# EAGLE design rcv_board (EAGLE 9.6.2)
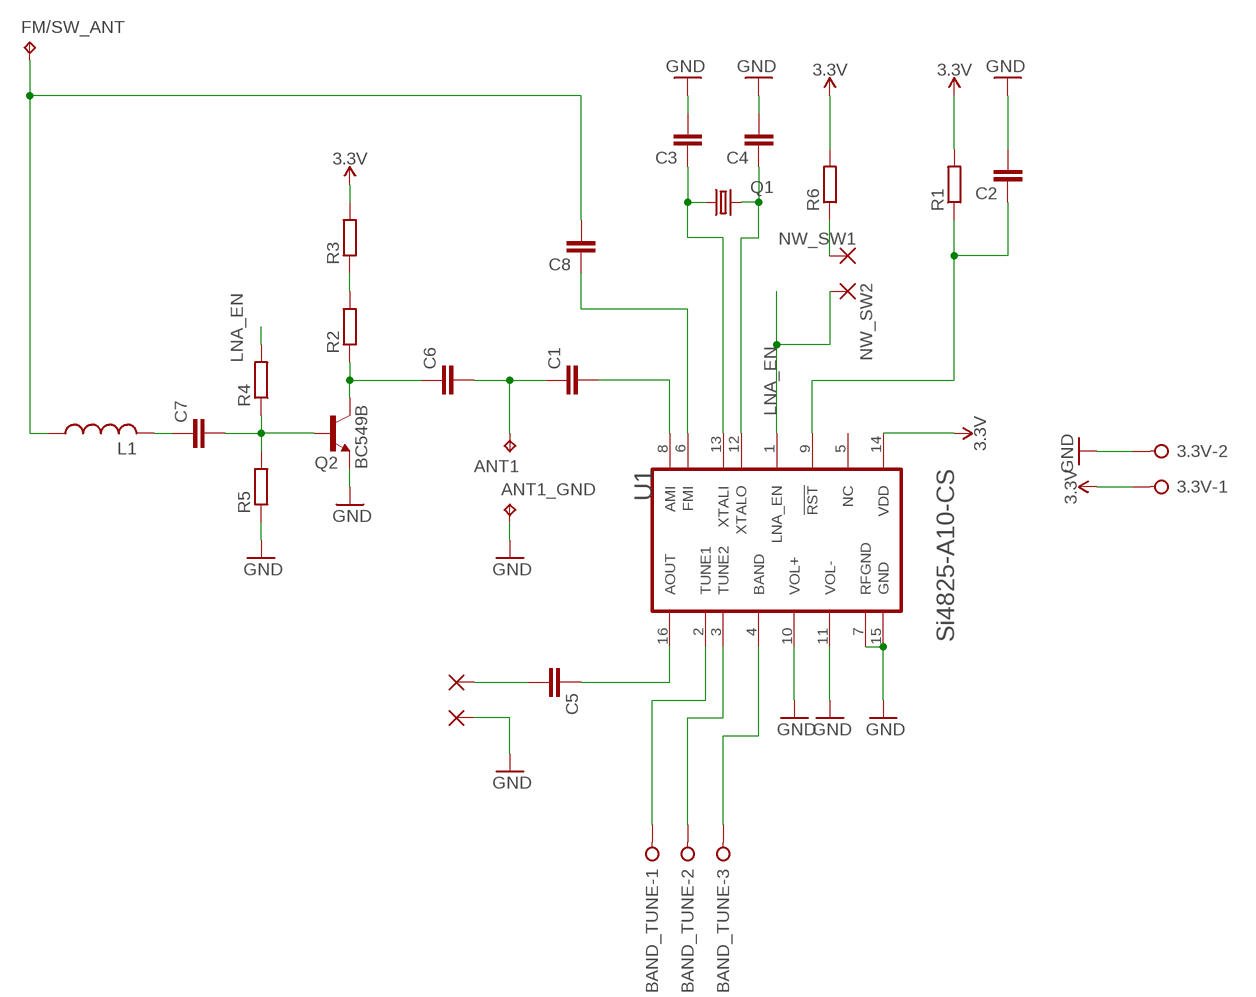
[diagram p0: schematic, sheet 1]

## Parts
3.3V  W237-02P  [W237-132]
ANT1  TPPAD1-20Y  [P1-20Y]
ANT1_GND  TPPAD1-20Y  [P1-20Y]
BAND_TUNE  W237-03P  [W237-133]
C1  C-EUC0805  [C0805]
C2  C-EUC0805  [C0805]
C3  C-EUC0805  [C0805]
C4  C-EUC0805  [C0805]
C5  C-EU050-035X075  [C050-035X075]
C6  C-EUC0805  [C0805]
C7  C-EUC0805  [C0805]
C8  C-EUC0805  [C0805]
FM/SW_ANT  TPPAD1-17  [P1-17]
L1  L-US0204V  [0204V]
OGND  NW_SW1  2,54/1,0  [2,54/1,0]
OUT  NW_SW1  2,54/1,0  [2,54/1,0]
PAD1  NW_SW1  2,54/1,0  [2,54/1,0]
PAD2  NW_SW2  2,54/1,0  [2,54/1,0]
Q1  KX-327-NHF  [3.2X1.5]
Q2  BC549B  [TO92-EBC]
R1  R-EU_R0805  [R0805]
R2  R-EU_R0805  [R0805]
R3  R-EU_R0805  [R0805]
R4  R-EU_R0805  [R0805]
R5  R-EU_R0805  [R0805]
R6  R-EU_R0805  [R0805]
U1  SILICON_LABS_SI4825-A10-CSSILICON_LABS_SI4825-A10-CS_0_2  [SILICON_LABS_SI4825-A10-CS_2]

## Nets
3.3V: 3.3V.1 R1.2 R3.2 R6.2 U1.14(VDD)
GND: 3.3V.2 ANT1_GND.TP C2.2 C3.2 C4.2 OGND.1(P) Q2.E R5.1 U1.7(RFGND) U1.10(VOL+) U1.11(VOL-) U1.15(GND)
LNA_EN: PAD2.1(P) R4.2 U1.1(LNA_EN)
N$1: C1.2 U1.8(AMI)
N$2: C2.1 R1.1 U1.9(!RST!)
N$3: C4.1 Q1.2 U1.12(XTALO)
N$4: C3.1 Q1.1 U1.13(XTALI)
N$5: C5.1 U1.16(AOUT)
N$6: C6.1 Q2.C R2.1
N$7: ANT1.TP C1.1 C6.2
N$8: R2.2 R3.1
N$9: C7.2 Q2.B R4.1 R5.2
N$10: C8.1 U1.6(FMI)
N$11: C7.1 L1.2
N$12: C8.2 FM/SW_ANT.TP L1.1
N$13: PAD1.1(P) R6.1
N$14: BAND_TUNE.3 U1.4(BAND)
N$15: BAND_TUNE.2 U1.3(TUNE2)
N$16: BAND_TUNE.1 U1.2(TUNE1)
N$17: C5.2 OUT.1(P)
Unconnected: U1.5(NC)

## Library data of the parts
3.3V = con-wago-508:W237-02P: WAGO SREW CLAMP; OC_FARNELL: unknown; OC_NEWARK: unknown
ANT1 ANT1_GND FM/SW_ANT = testpad:TP: Test pad
BAND_TUNE = con-wago-508:W237-03P: WAGO SREW CLAMP; OC_FARNELL: unknown; OC_NEWARK: unknown
C1-C8 = rcl:C-EU: CAPACITOR, European symbol; SPICEPREFIX: C
L1 = rcl:L-US: INDUCTOR, American symbol; SPICEPREFIX: L
OGND OUT PAD1 PAD2 = wirepad:2,54/1,0: THROUGH-HOLE PAD
Q1 = crystal-geyer_V1_0:KX-327: Tuning Fork Crystals (kHz) SMD: KX327 - Serie Model Size l/w/h [mm] Frequency Range Frequency Stability Temp. Range [°C] Load Capacitance AECQ 200 availabel Datasheet KX-327VT KX-327FT KX-327RT KX-327NHT KX-327NHF KX-327L KX-327S 1.25/1.05/0.5 1.6/1.0/0.5 2.0/1.2/0.6 3.2/1.5/0.8 3.2/1.5/0.8 7.0/1.5/1.4 8.2/3.8/2.5 32,768 kHz 32,768 kHz 32,768 kHz 32,768 kHz 32,768 kHz 32,768 kHz 32,768 kHz ±10 … ±20ppm ±10 … ±20ppm ±10 … ±20ppm ±10 … ±20ppm ±10 … ±20ppm ±10 … ±20ppm ±5 … ±20ppm (*) -40°C …+85°C (*) -40°C …+85°C (*) -40°C …+85°C (*) -40°C …+85°C (*) -40°C …+125°C (*) -40°C …+85°C (*) -40°C …+85°C 7/9/12,5 7/9/12,5 7/9/12,6 7/9/12,5 9/12,5 7/9/12,5 6/12,5 - - - - yes - - KX-327VT.pdf <http://www.geyer-electronic.de/uploads/tx_userartikelfrequenz/GEYER-KX-327VT.pdf> KX-327FT.pdf <http://www.geyer-electronic.de/uploads/tx_userartikelfrequenz/GEYER-KX-327FT.pdf> KX-327RT.pdf <http://www.geyer-electronic.de/uploads/tx_userartikelfrequenz/GEYER-KX-327RT.pdf> KX-327NHT.pdf <http://www.geyer-electronic.de/uploads/tx_userartikelfrequenz/GEYER-KX-327NHT.pdf> KX-327NHF.pdf <http://www.geyer-electronic.de/uploads/tx_userartikelfrequenz/GEYER-KX-327NHF.pdf> KX-327L.pdf <http://www.geyer-electronic.de/uploads/tx_userartikelfrequenz/GEYER-KX-327L.pdf> KX-327S.pdf <http://www.geyer-electronic.de/uploads/tx_userartikelfrequenz/GEYER-KX-327S.pdf> <http://www.geyer-electronic.de/fileadmin/template/img/logo-geyer-electronic.png> Details see: http://www.geyer-electronic.de/Frequenz-Produkte.9.0.html Created 2016-06-07, Hans Locher 2016 (C) Geyer Quartz Technology KX327VT,KX327FT,KX327RT,KX327NHT,KX327NHF,KX327S,KX327L;125105;1610;2012;3215;7015;8238;1,25x1,05,1.25x1.05;1,6x1,0,1.6x1.0;2,0x1,2,2.0x1.2;3,2x1,5,3.2x1.5;8,2x3,8,8.2x3.8,7.0x1.5,7,0x1,532.768kHz
Q2 = transistor-npn:BC549*: NPN Transistor
R1-R6 = rcl:R-EU_: RESISTOR, European symbol; SPICEPREFIX: R
U1 = Silicon Labs - Si4825-A10-CS:SILICON_LABS_SI4825-A10-CS: SLAB-Si4825-SOIC-16-NB-16; CIIVA_IDS: 8865163; CODE__IPC: J-STD-020; CODE__JEDEC: MS-012; COMPONENT_LINK_1_DESCRIPTION: Manufacturer URL; COMPONENT_LINK_1_URL: http://www.silabs.com/; COMPONENT_LINK_3_DESCRIPTION: Package Specification; COMPONENT_LINK_3_URL: http://www.silabs.com/Support%20Documents/TechnicalDocs/si2401.pdf; DATASHEET: http://www.silabs.com/Support Documents/TechnicalDocs/Si4825-A10.pdf; DATASHEET_VERSION: Rev. 1.0; FOOTPRINT_VARIANT_NAME_0: Level C; FOOTPRINT_VARIANT_NAME_1: Level B; FOOTPRINT_VARIANT_NAME_2: Level A; IMPORTED: yes; IMPORTED_FROM: vault; IMPORT_TS: 1521848159; MF: Silicon Labs; MOUNTING_TECHNOLOGY: Surface Mount; MPN: Si4825-A10-CS; PACKAGE: SOIC-16-NB; PACKAGE_DESCRIPTION: 16-Pin Small-Outline Integrated Circuit, Body 9.9 x 3.9 mm, Pitch 1.27 mm; PIN_0_0_12_INSIDE_EDGE: clock; PREFIX: U; RDS_SUPPORT: false; RELEASE_DATE: 1382427841; SUB__FAMILY: AM/FM, Shortwave, Longwave, Weather Band Receivers; VAULT_GUID: FF627C0C-6F04-4CD9-A8DD-D8BCD44C89B6; VAULT_REVISION: 47CE571D-67E0-476C-8CEC-131F609130D3

## Board
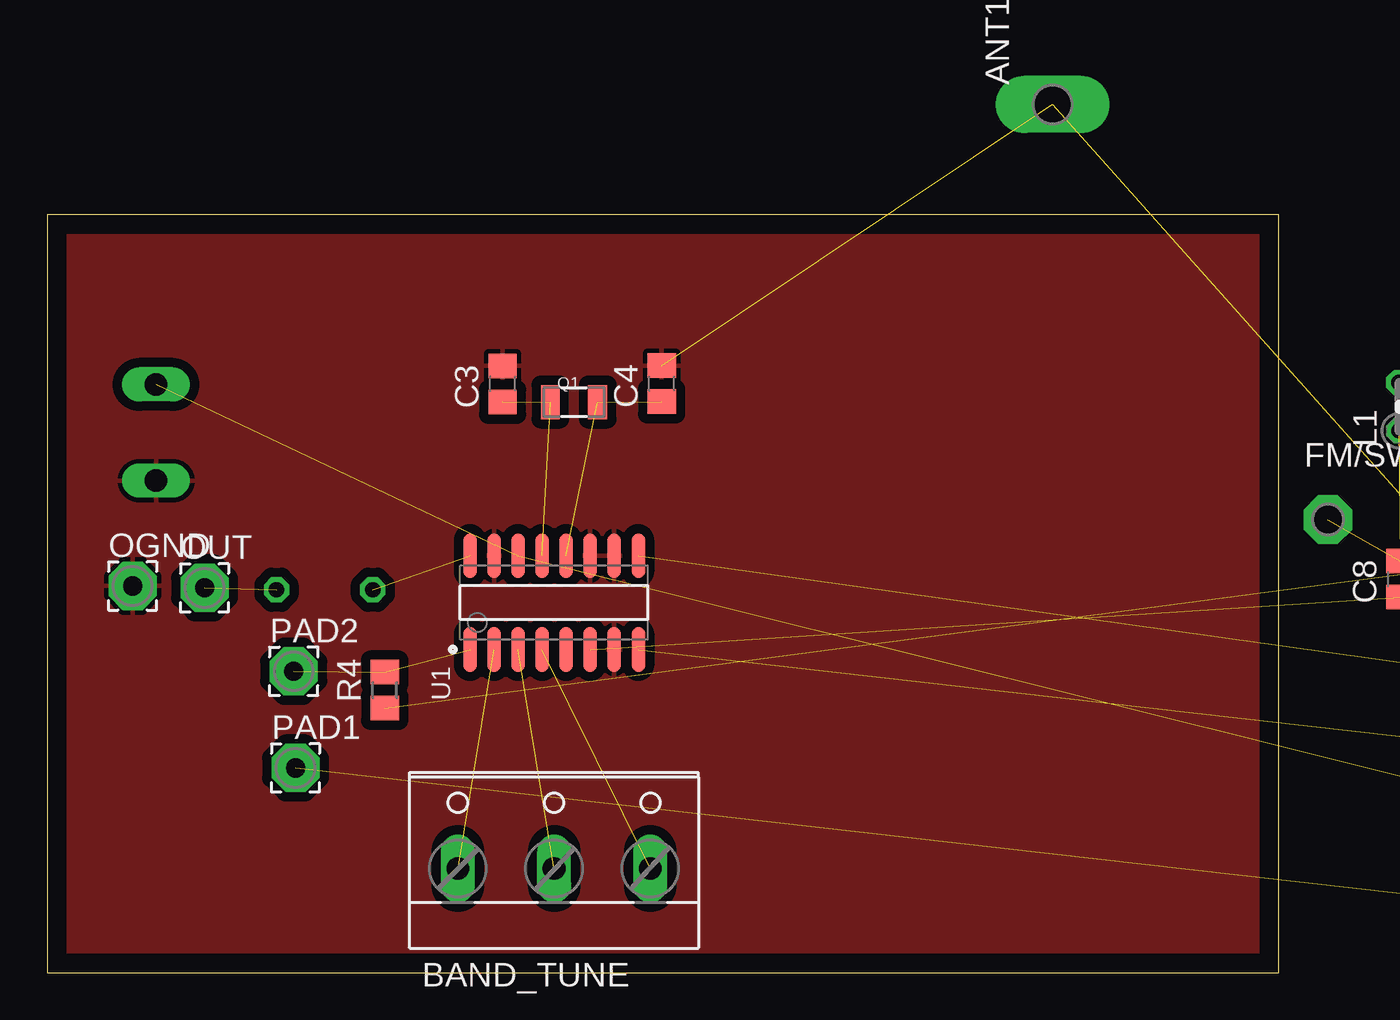
[diagram p1: board, top side]
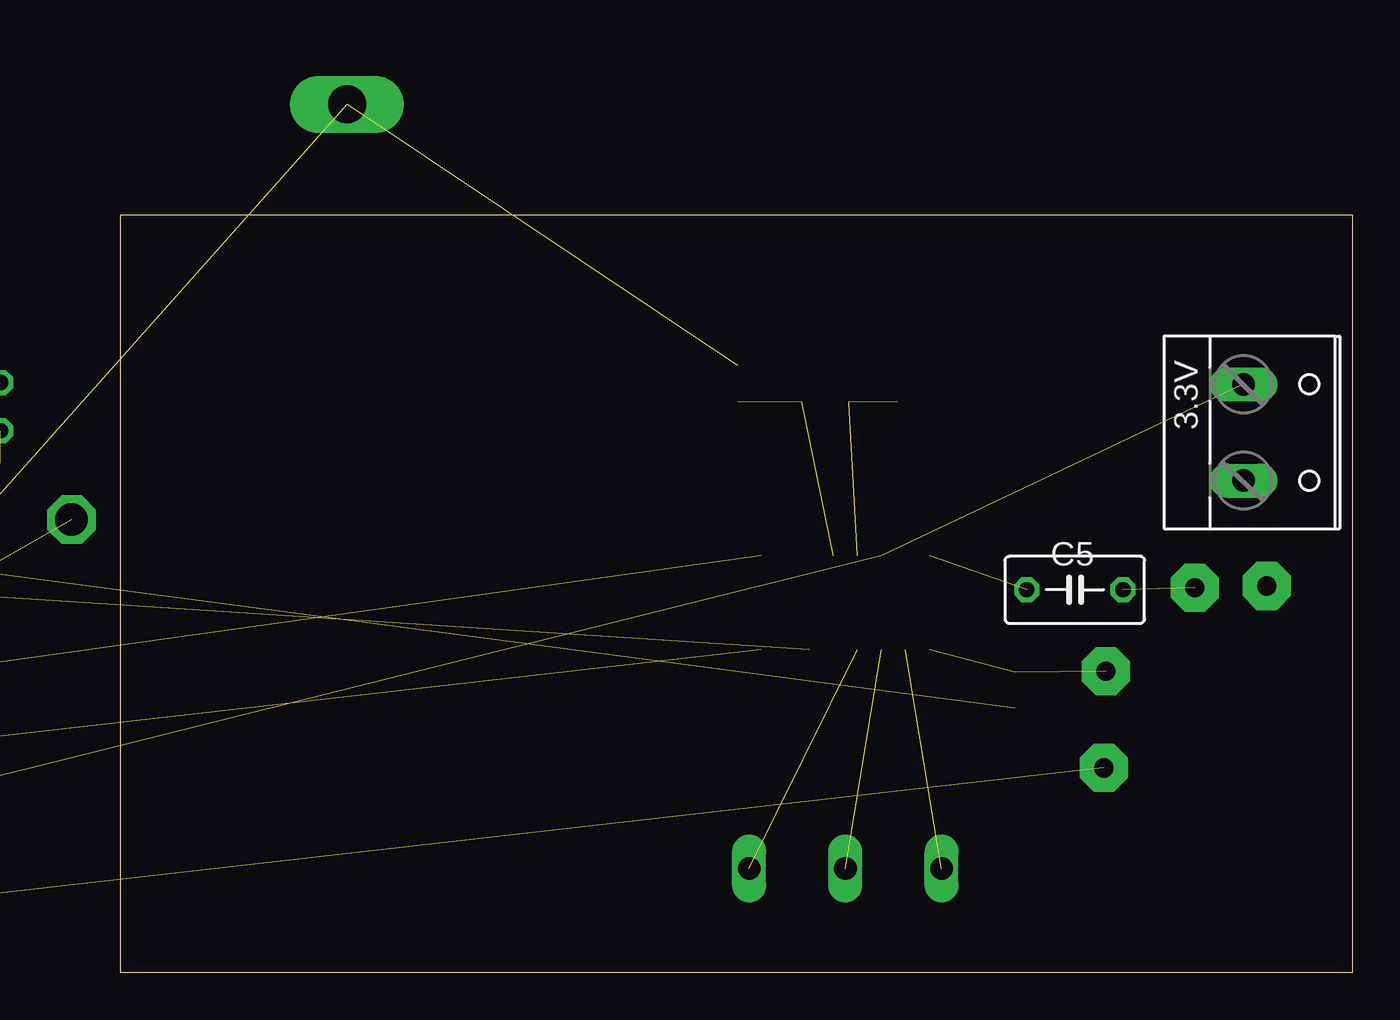
[diagram p2: board, bottom side, seen from below]

Size 65 x 40 mm. Coordinates in mm from the lower left corner, seen from the top.
Outline: 0,0 65,0 65,40 0,40 0,0
Copper layers (1*16): Top 0.035mm / dielectric 1.5mm / Bottom 0.035mm
Design rules "default": minimum track width 6mil, minimum drill 0.35mm, track to track 6mil, track to pad 6mil, pad to pad 6mil, via to via 6mil, smd to smd 6mil, copper to edge 40mil, drill to drill 6mil, minimum pad ring 10mil, minimum via ring 8mil, stop-mask expansion 4mil, vias tented up to drill 0mil, thermal gap 10mil

### Footprints (pad centres in the part's own frame; a part is rotated, then mirrored left to right if it is on the bottom)
W237-132 = drill 1.194 long: 1 -2.54,-0.635; 2 2.54,-0.635
P1-20Y = drill 2.007 pad 2.54 long: TP 0,0
W237-133 = drill 1.194 long: 1 -5.08,-0.635; 2 0,-0.635; 3 5.08,-0.635
C0805 = smd 1.3 x 1.5: 1 -0.95,0; 2 0.95,0
C050-035X075 = drill 0.813 octagon: 1 -2.54,0; 2 2.54,0
P1-17 = drill 1.702 pad 2.54 octagon: TP 0,0
0204V = drill 0.813 octagon: 1 -1.27,0; 2 1.27,0
2,54/1,0 = drill 1.016 pad 2.54 octagon: 1 0,0
3.2X1.5 = smd 1 x 1.8: 1 -1.25,0; 2 1.25,0
TO92-EBC = drill 0.813 long: B 0,-1.27; C -2.54,-1.27; E 2.54,-1.27
R0805 = smd 1.3 x 1.5: 1 -0.95,0; 2 0.95,0
SILICON_LABS_SI4825-A10-CS_2 = smd 2.35 x 0.7: 1 -2.475,4.445; 2 -2.475,3.175; 3 -2.475,1.905; 4 -2.475,0.635; 5 -2.475,-0.635; 6 -2.475,-1.905; 7 -2.475,-3.175; 8 -2.475,-4.445; 9 2.475,-4.445; 10 2.475,-3.175; 11 2.475,-1.905; 12 2.475,-0.635; 13 2.475,0.635; 14 2.475,1.905; 15 2.475,3.175; 16 2.475,4.445

### Placement (x,y rotation side)
3.3V  5.1,28.5 270 bottom
ANT1  85.46,2.34 0 top  (outside the outline)
ANT1_GND  53.06,45.81 90 top  (outside the outline)
BAND_TUNE  26.75,6.12 0 top
C1  85.11,9.96 90 top  (outside the outline)
C2  76.71,16.58 90 top  (outside the outline)
C3  24.03,31.06 90 top
C4  32.43,31.08 90 top
C5  14.64,20.2 0 bottom
C6  87.18,14.23 180 top  (outside the outline)
C7  76.27,26.36 270 top  (outside the outline)
C8  71.43,20.76 90 top  (outside the outline)
FM/SW_ANT  67.6,23.9 0 top
L1  71.35,29.86 90 top  (outside the outline)
OGND  4.5,20.4 0 top
OUT  8.3,20.3 0 top
PAD1  13.1,10.8 0 top
PAD2  13,15.9 0 top
Q1  27.8,30.1 0 top
Q2  79.35,17.96 90 top  (outside the outline)
R1  76.7,10.02 270 top  (outside the outline)
R2  80.59,10.14 270 top  (outside the outline)
R3  80.69,4.62 270 top  (outside the outline)
R4  17.81,14.9 90 top
R5  75.52,21.69 0 top  (outside the outline)
R6  76.81,4.54 90 top  (outside the outline)
U1  26.75,19.52 90 top

### Tracks (layer width: path | path; a pad name or v marks a point on that pad's centre or on a via)
3.3V  (4 unrouted)
GND  (4 unrouted)
  pour Top (isolate 0.5): 66.9,-1.3 -1,-1.3 -1,41.6 66.9,41.6
LNA_EN  (2 unrouted)
N$1  (1 unrouted)
N$2  (2 unrouted)
N$3  (2 unrouted)
N$4  (2 unrouted)
N$5  (1 unrouted)
N$6  (2 unrouted)
N$7  (2 unrouted)
N$8  (1 unrouted)
N$9  (3 unrouted)
N$10  (1 unrouted)
N$11  (1 unrouted)
N$12  (2 unrouted)
N$13  (1 unrouted)
N$14  (1 unrouted)
N$15  (1 unrouted)
N$16  (1 unrouted)
N$17  (1 unrouted)